# EAGLE design SparkFun_TEMT6000_Breakout-v12 (EAGLE 7.2.0)
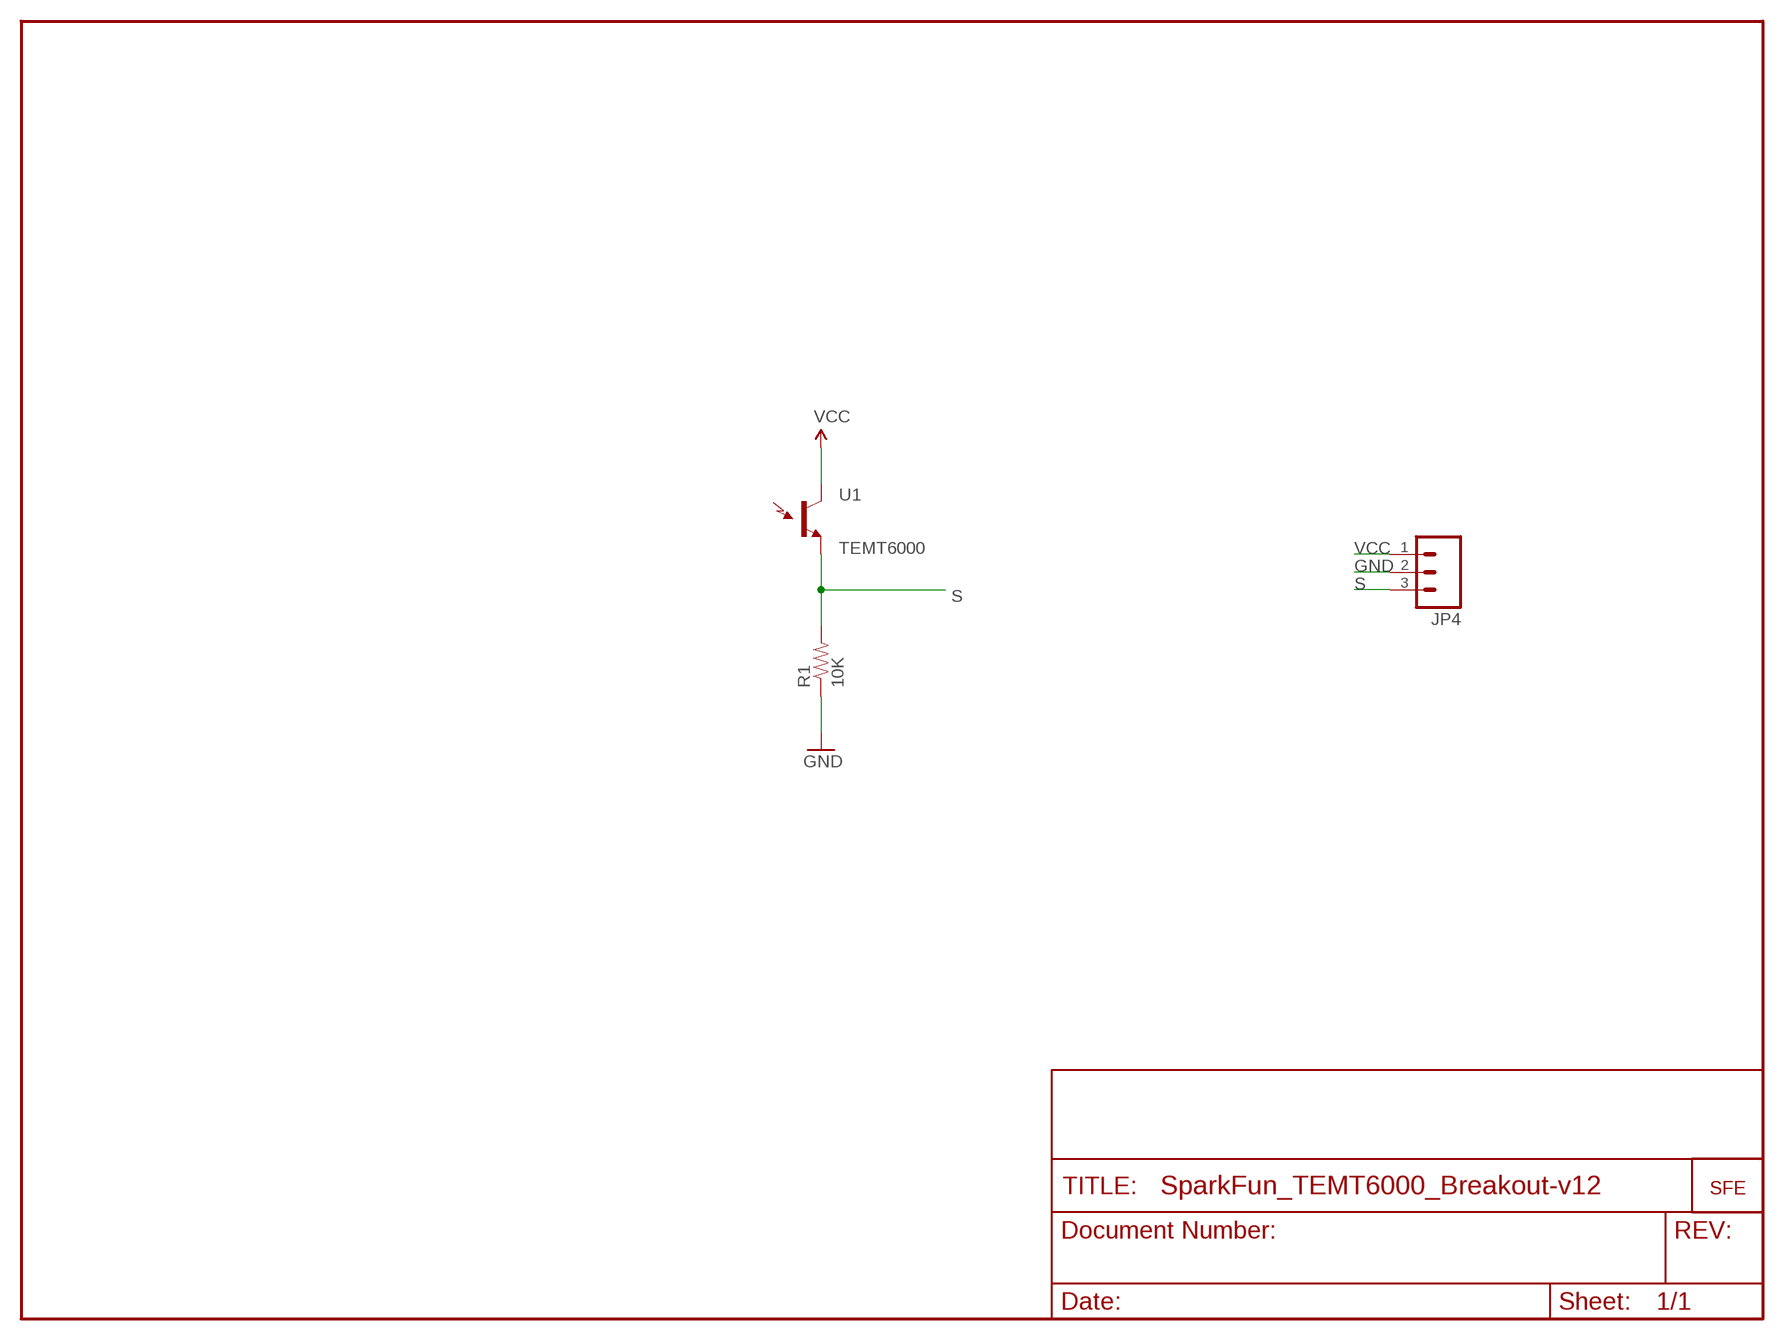
[diagram p0: schematic, sheet 1]

## Parts
JP4  M03PTH  [1X03]
R1  10K  RESISTOR0402-RES  [0402-RES]
U1  TEMT6000  [TEMT6000-SEN]
U$1  LOGO-SFESK  [SFE-LOGO-FLAME]

## Nets
GND: JP4.2 R1.1
S: JP4.3 R1.2 U1.EMITTER(E1)
VCC: JP4.1 U1.COLLECTOR(C1)

## Library data of the parts
JP4 = SparkFun:M03: Header 3 Standard 3-pin 0.1" header. Use with straight break away headers (SKU : PRT-00116), right angle break away headers (PRT-00553), swiss pins (PRT-00743), machine pins (PRT-00117), and female headers (PRT-00115). Molex polarized connector foot print use with SKU : PRT-08232 with associated crimp pins and housings.
R1 = SparkFun:RESISTOR: Resistor Basic schematic elements and footprints for 0603, 1206, and PTH 1/10th watt (small) resistors.
U1 = SparkFun:TEMT6000: Ambient Light Sensor Simple light detection sensor. Output varies with light intensity input. Spark Fun Electronics SKU : COM-08348
U$1 = SparkFun:LOGO-SFE: Spark Fun Electronics PCB Logo This is the standard Spark Fun Electronics PCB logo.

## Board
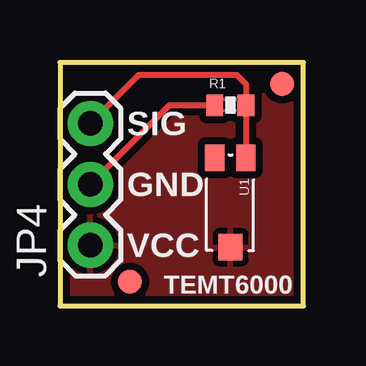
[diagram p1: board, top side]
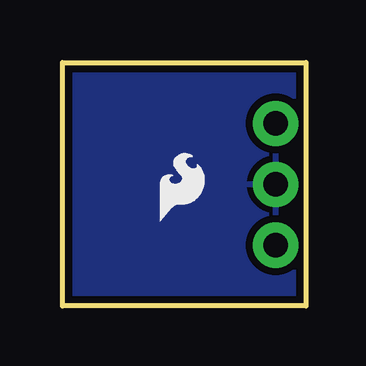
[diagram p2: board, bottom side, seen from below]

Size 10.16 x 10.16 mm. Coordinates in mm from the lower left corner, seen from the top.
Outline: 0,0 10.16,0 10.16,10.16 0,10.16 0,0
Copper layers (1*16): Top 0.035mm / dielectric 1.5mm / Bottom 0.035mm
Design rules "SparkFun": minimum track width 8mil, minimum drill 20mil, track to track 8mil, track to pad 8mil, pad to pad 8mil, via to via 8mil, smd to smd 8mil, copper to edge 10mil, drill to drill 8mil, minimum pad ring 12mil, minimum via ring 10mil, stop-mask expansion 4mil, vias tented up to drill 20mil, thermal gap 10mil

### Footprints (pad centres in the part's own frame; a part is rotated, then mirrored left to right if it is on the bottom)
FIDUCIAL-1X2 = smd 1 x 1: 1 0,0
1X03 = drill 1.016 pad 1.88: 1 0,0; 2 2.54,0; 3 5.08,0
0402-RES = smd 0.7 x 0.9: 1 -0.65,0; 2 0.65,0
TEMT6000-SEN = smd 1.1 x 0.8: BASE -1.87,-0.65; EMITTER -1.87,0.65 | smd 1.1 x 1: COLLECTOR 1.86,0.01

### Placement (x,y rotation side)
E$1  [FIDUCIAL-1X2]  9.27,9.27 0 top
E$2  [FIDUCIAL-1X2]  2.92,1.02 0 top
JP4  1.27,2.54 90 top
R1  7.11,8.38 0 top
U1  7.11,4.32 270 top
U$1  6.1,3.56 0 bottom

### Tracks (layer width: path | path; a pad name or v marks a point on that pad's centre or on a via)
GND
  Top 0.254: R1.1 4.57,8.38 JP4.2
  pour Bottom (isolate 0.305): 0,10.16 10.16,10.16 10.16,0 0,0
S
  Top 0.254: 7.78,6.19 7.87,6.1 | 7.78,6.19 U1.EMITTER | 7.78,6.19 7.76,6.21 R1.2 7.76,9.26 7.37,9.65 3.3,9.65 JP4.3
VCC
  pour Top (isolate 0.305): 0,10.16 0,0 10.16,0 10.16,10.16

### Text on the board
tPlace: SIG | GND | VCC | TEMT6000